# Altium project nse5310-module-stm32.PrjPcb
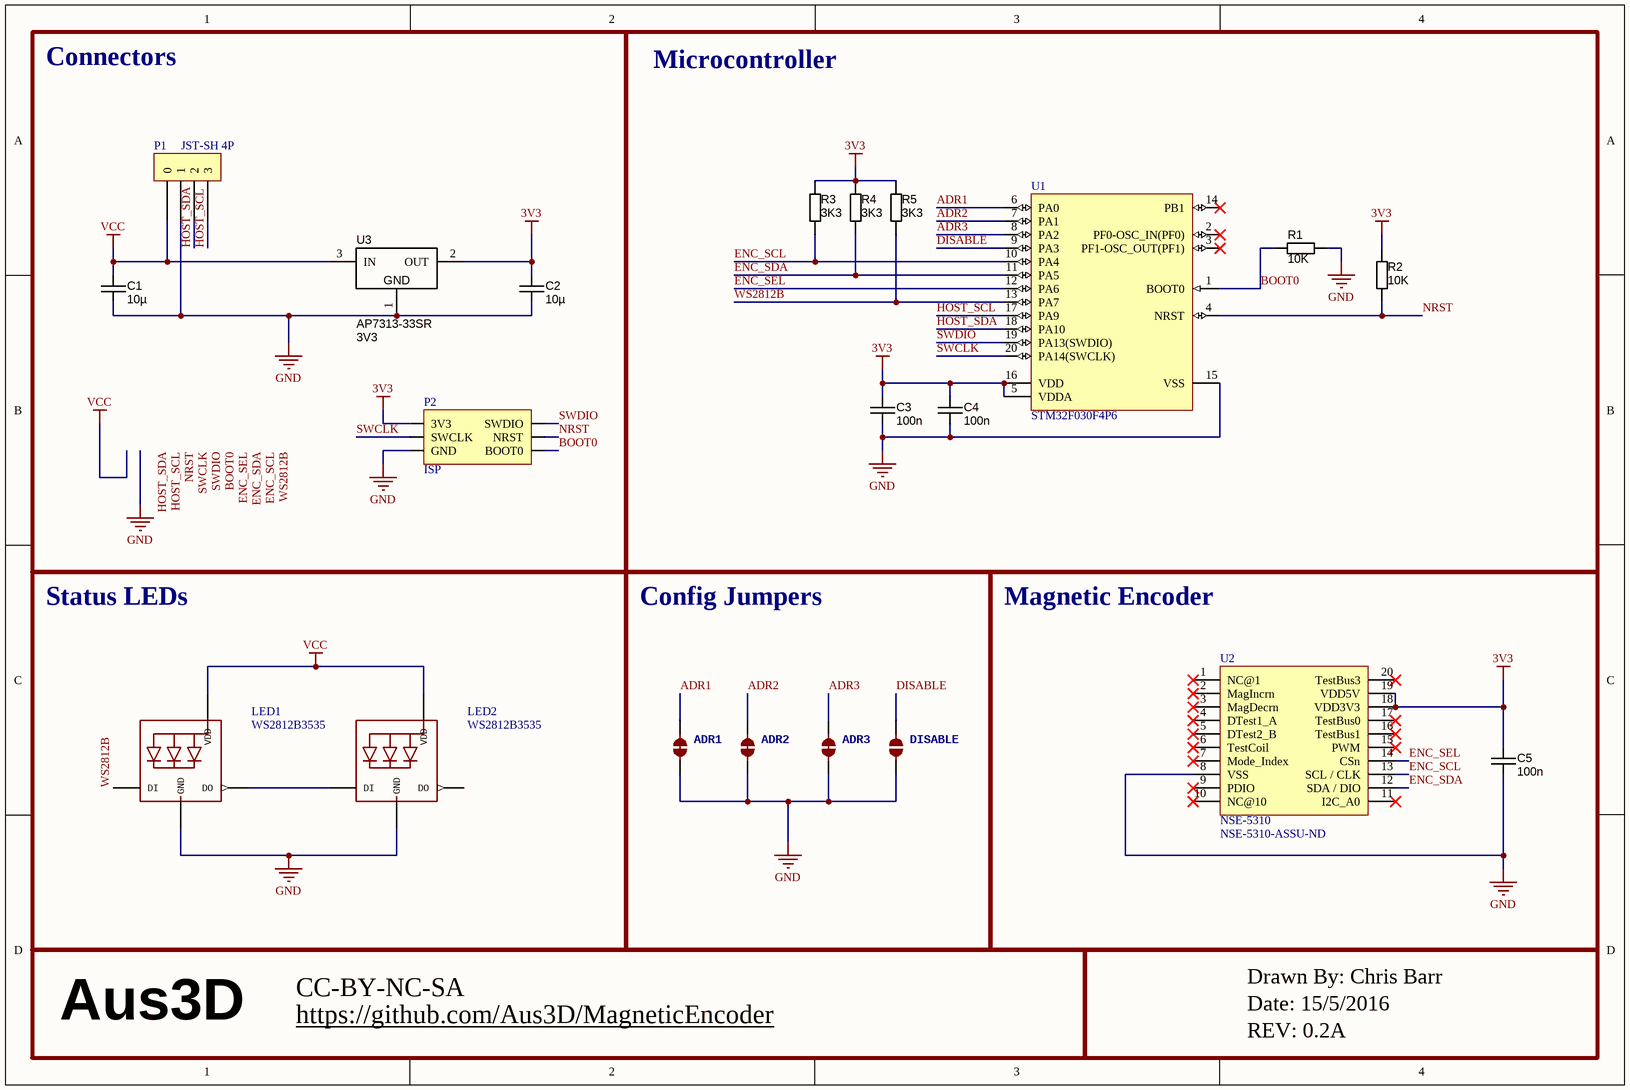
[diagram p0: nse5310-module-stm32.SchDoc]
1 sheet, 21 parts. Net scope: global (net labels, ports and power ports of the same name join across sheets).
Board file: nse5310-module-stm32.PcbDoc

## Sheet nse5310-module-stm32.SchDoc
size 304 x 203 mm

### Parts
ADR1  JUMPER-PAD-2-NC_BY_TRACE  [PAD-JUMPER-2-NC_BY_TRACE_YES_SILK]  (value not drawn)
ADR2  JUMPER-PAD-2-NC_BY_TRACE  [PAD-JUMPER-2-NC_BY_TRACE_YES_SILK]  (value not drawn)
ADR3  JUMPER-PAD-2-NC_BY_TRACE  [PAD-JUMPER-2-NC_BY_TRACE_YES_SILK]  (value not drawn)
C1  value 10µ  [CAPC2012X135N]  (hidden comment: approved sub OK)
C2  value 10µ  [CAPC2012X135N]  (hidden comment: approved sub OK)
C3  value 100n  [CAPC1608X90N]  (hidden comment: approved sub OK)
C4  value 100n  [CAPC1608X90N]  (hidden comment: approved sub OK)
C5  value 100n  [CAPC1608X90N]  (hidden comment: approved sub OK)
DISABLE  JUMPER-PAD-2-NO  [PAD-JUMPER-2-NO_NO_SILK]  (value not drawn)
LED1  WS2812B3535  [LED3535]
LED2  WS2812B3535  [LED3535]
P1  JST-SH 4P  [SM04B-SRSS-TB]
P2  ISP  [ICSP Pads - SMD]  (no BOM)
R1  value 10K  [RESC1608X55N]  (hidden comment: Thick Film)
R2  value 10K  [RESC1608X55N]  (hidden comment: Thick Film)
R3  value 3K3  [RESC1608X55N]  (hidden comment: Thick Film)
R4  value 3K3  [RESC1608X55N]  (hidden comment: Thick Film)
R5  value 3K3  [RESC1608X55N]  (hidden comment: Thick Film)
U1  STM32F030F4P6  [STM-TSSOP20_N]
U2  NSE-5310  Supplier Part Number 1: NSE-5310-ASSU-ND  [NSE-5310]
U3  AP7313-33SR  value 3V3  [SOT23-3]

### Blocks framed on the sheet
Connectors: C1 C2 P1 P2 U3
Microcontroller: C3 C4 R1-R5 U1
Status LEDs: LED1 LED2
Config Jumpers: ADR1-ADR3 DISABLE
Magnetic Encoder: C5 U2

### Nets
3V3: C2.1 C3.1 C4.1 C5.1 P2.0(3V3) R2.2 R3.1 R4.1 R5.1 U1.5(VDDA) U1.16(VDD) U2.18(VDD3V3) U2.19(VDD5V) U3.2(OUT)
GND: ADR1.1 ADR2.1 ADR3.1 C1.2 C2.2 C3.2 C4.2 C5.2 DISABLE.2 LED1.4(GND) LED2.4(GND) P1.1 P2.4(GND) R1.2 U1.15(VSS) U2.8(VSS) U3.1(GND)
VCC: C1.1 LED1.2(VDD) LED2.2(VDD) P1.0 U3.3(IN)
ADR1: ADR1.2 U1.6(PA0)
ADR2: ADR2.2 U1.7(PA1)
ADR3: ADR3.2 U1.8(PA2)
BOOT0: P2.5(BOOT0) R1.1 U1.1(BOOT0)
DISABLE: DISABLE.1 U1.9(PA3)
ENC_SCL: R3.2 U1.10(PA4) U2.13(SCL_/_CLK)
ENC_SDA: R4.2 U1.11(PA5) U2.12(SDA_/_DIO)
ENC_SEL: U1.12(PA6) U2.14(CSn)
HOST_SCL: P1.3 U1.17(PA9)
HOST_SDA: P1.2 U1.18(PA10)
NRST: P2.3(NRST) R2.1 U1.4(NRST)
SWCLK: P2.2(SWCLK) U1.20(PA14(SWCLK))
SWDIO: P2.1(SWDIO) U1.19(PA13(SWDIO))
WS2812B: LED1.1(DI) R5.2 U1.13(PA7)
NetLED1_3: LED1.3(DO) LED2.1(DI)

Not connected (* = marked no-connect by the designer): LED2 3(DO); U1 2(PF0-OSC_IN(PF0))* 3(PF1-OSC_OUT(PF1))* 14(PB1)*; U2 1(NC@1)* 2(MagIncrn)* 3(MagDecrn)* 4(DTest1_A)* 5(DTest2_B)* 6(TestCoil)* 7(Mode_Index)* 9(PDIO)* 10(NC@10)* 11(I2C_A0)* 15(PWM)* 16(TestBus1)* 17(TestBus0)* 20(TestBus3)*

### Notes on the sheet
- Aus3D
- https://github.com/Aus3D/MagneticEncoder
- CC-BY-NC-SA
- Drawn By: Chris Barr
- Date: 15/5/2016
- REV: 0.2A
- Labels drawn without touching a wire or pin: BOOT0, ENC_SCL, ENC_SDA, ENC_SEL, HOST_SCL, HOST_SDA, NRST, SWCLK, SWDIO, WS2812B

### Library data of the parts
C1 C2 = CAPC_10u_0805_10V: Capacitor SMD Cer 10uF 10% 10V X5R 0805; Manufacturer 1: AVX Corporation; Manufacturer Part Number 1: 0805ZD106KAT2A; Ratings: 10V; X5R; Material: ceramic; SCDType: spec; Package / Case: 0805 (2012 metric); Tolerance: ±10%; Manufacturer 2: Kemet; Manufacturer Part Number 2: C0805C106K8PACTU; Supplier 1: Digi-Key; Supplier Part Number 1: 478-5167-1-ND; ComponentLink1URL: http://www.avx.com/docs/Catalogs/cx5r.pdf; ComponentLink1Description: http://www.avx.com/docs/Catalogs/cx5r.pdf; ComponentLink2URL: http://www.kemet.com/datasheets&C0805C106K8PACTU; ComponentLink2Description: http://www.kemet.com/datasheets&C0805C106K8PACTU; Supplier 2: Digi-Key; Supplier Part Number 2: 399-4925-1-ND
C3-C5 = CAPC_100n_0603_X7R_50V_10%: Capacitor SMD Cer 100nF 10% 50V X7R 0603; Manufacturer 1: AVX Corporation; Manufacturer Part Number 1: 06035C104KAT2A; Ratings: 50V; X7R; Material: ceramic; SCDType: spec; Manufacturer 2: TDK Corporation; Manufacturer Part Number 2: C1608X7R1H104K; Package / Case: 0603 (1608 Metric); Tolerance: ±10%; Supplier 1: Digi-Key; Supplier Part Number 1: 478-5052-1-ND; ComponentLink1URL: http://www.avx.com/docs/Catalogs/cx7r.pdf; ComponentLink1Description: http://www.avx.com/docs/Catalogs/cx7r.pdf; Supplier 2: Digi-Key; Supplier Part Number 2: 445-1314-1-ND; ComponentLink2URL: http://product.tdk.com/capacitor/mlcc/en/documents/mlcc_commercial_general_en.pdf; ComponentLink2Description: http://product.tdk.com/capacitor/mlcc/en/documents/mlcc_commercial_general_en.pdf
LED1 LED2 = WS2812B3535: Manufacturer 1: DONGGUANG OPSCO OPTOELECTRONICS CO., LTD; Manufacturer Part Number 1: SK6812MINI
P1 = SM04B-SRSS-TB: Supplier 1: Digi-Key; Supplier Part Number 1: 455-1804-1-ND
P2 = ISP Header
R1 R2 = RES_10K_0603_5%: Resistor SMD chip 10k Ohm 0.1W 5% 0603; Manufacturer 1: Yageo; Manufacturer Part Number 1: RC0603JR-0710KL; Ratings: 1/10 W; SCDType: spec; Package / Case: 0603 (1608 metric); Tolerance: ±5%; Material: Thick Film; Supplier 1: Digi-Key; Supplier Part Number 1: 311-10KGRCT-ND; Supplier 2: Digi-Key; Supplier Part Number 2: 541-10KGCT-ND; Manufacturer 2: Vishay Dale; Manufacturer Part Number 2: CRCW060310K0JNEA; ComponentLink2URL: http://www.vishay.com/doc?20035; ComponentLink2Description: http://www.vishay.com/doc?20035; ComponentLink1URL: http://www.yageo.com/documents/recent/PYu-RC0603_51_RoHS_L_4.pdf; ComponentLink1Description: http://www.yageo.com/documents/recent/PYu-RC0603_51_RoHS_L_4.pdf
R3-R5 = RES_3K3_0603_5%: Resistor SMD chip 3.3k Ohm 0.1W 5% 0603; Manufacturer 1: Yageo; Manufacturer Part Number 1: RC0603JR-073K3L; Ratings: 1/10 W; SCDType: undef; Package / Case: 0603 (1608 metric); Tolerance: ±5%; Material: thick film; Supplier 1: Digi-Key; Supplier Part Number 1: 311-3.3KGRTR-ND
U1 = STM32F030F4P6: ARM Cortex-M0 32-bit MCU, 16 KB Flash, 4 KB Internal RAM, 15 I/Os, 20-pin TSSOP, -40 to 85 degC, Tube; FLASH Size (Prog) (kB): 16; I/Os (High Current): 15; Internal RAM Size (kB): 4; Operating Frequency(F) (Processor speed) (MHz): 48; Supply Voltage(Vcc) min (V): 2.4; DatasheetVersion: Rev. 1; PackageVersion: Rev. 1, 11/2012; PackageReference: TSSOP20; PackageDescription: 20-Pin Thin Shrink Small Outline Package, 6.5 x 4.4 mm Body, 0.65 mm Pitch; Supplier 1: Digi-Key; Supplier Part Number 1: 497-14044-5-ND; Supplier 2: Newark; Supplier Part Number 2: 06X3648; Supplier 3: Mouser; Supplier Part Number 3: 511-STM32F030F4P6; Core: ARM Cortex-M0; Packing: Tube; Mounting Technology: Surface Mount; PartNumber: STM32F030F4P6; ComponentLink1Description: Manufacturer URL; ComponentLink1URL: http://www.st.com/web/en/home.html; ComponentLink2Description: Datasheet; ComponentLink2URL: http://www.st.com/st-web-ui/static/active/en/resource/technical/document/datasheet/DM00088500.pdf; ComponentLink3Description: Package Specification; ComponentLink3URL: http://www.st.com/st-web-ui/static/active/en/resource/technical/document/datasheet/DM00065136.pdf
U3 = VREG_3V3_AP7313-33SR: Voltage Regulator 3.3V LDO SOT23R-3 SMD; Manufacturer 1: Diodes Inc; Manufacturer Part Number 1: AP7313-33SRG-7; Voltage Regulator Type: Low Drop-Out (LDO); Tolerance: ±2%; Ratings: 6Vin; 150mA; SCDType: source; Package / Case: SOT23R-3; Supplier 1: Digi-Key; Supplier Part Number 1: AP7313-33SRG-7DICT-ND; ComponentLink1URL: http://www.diodes.com/datasheets/AP7313.pdf; ComponentLink1Description: AP7313 datasheet
U2 = NSE-5310: Supplier 1: Digi-Key